# EAGLE design riffle-0.5 (EAGLE 7.2.0)
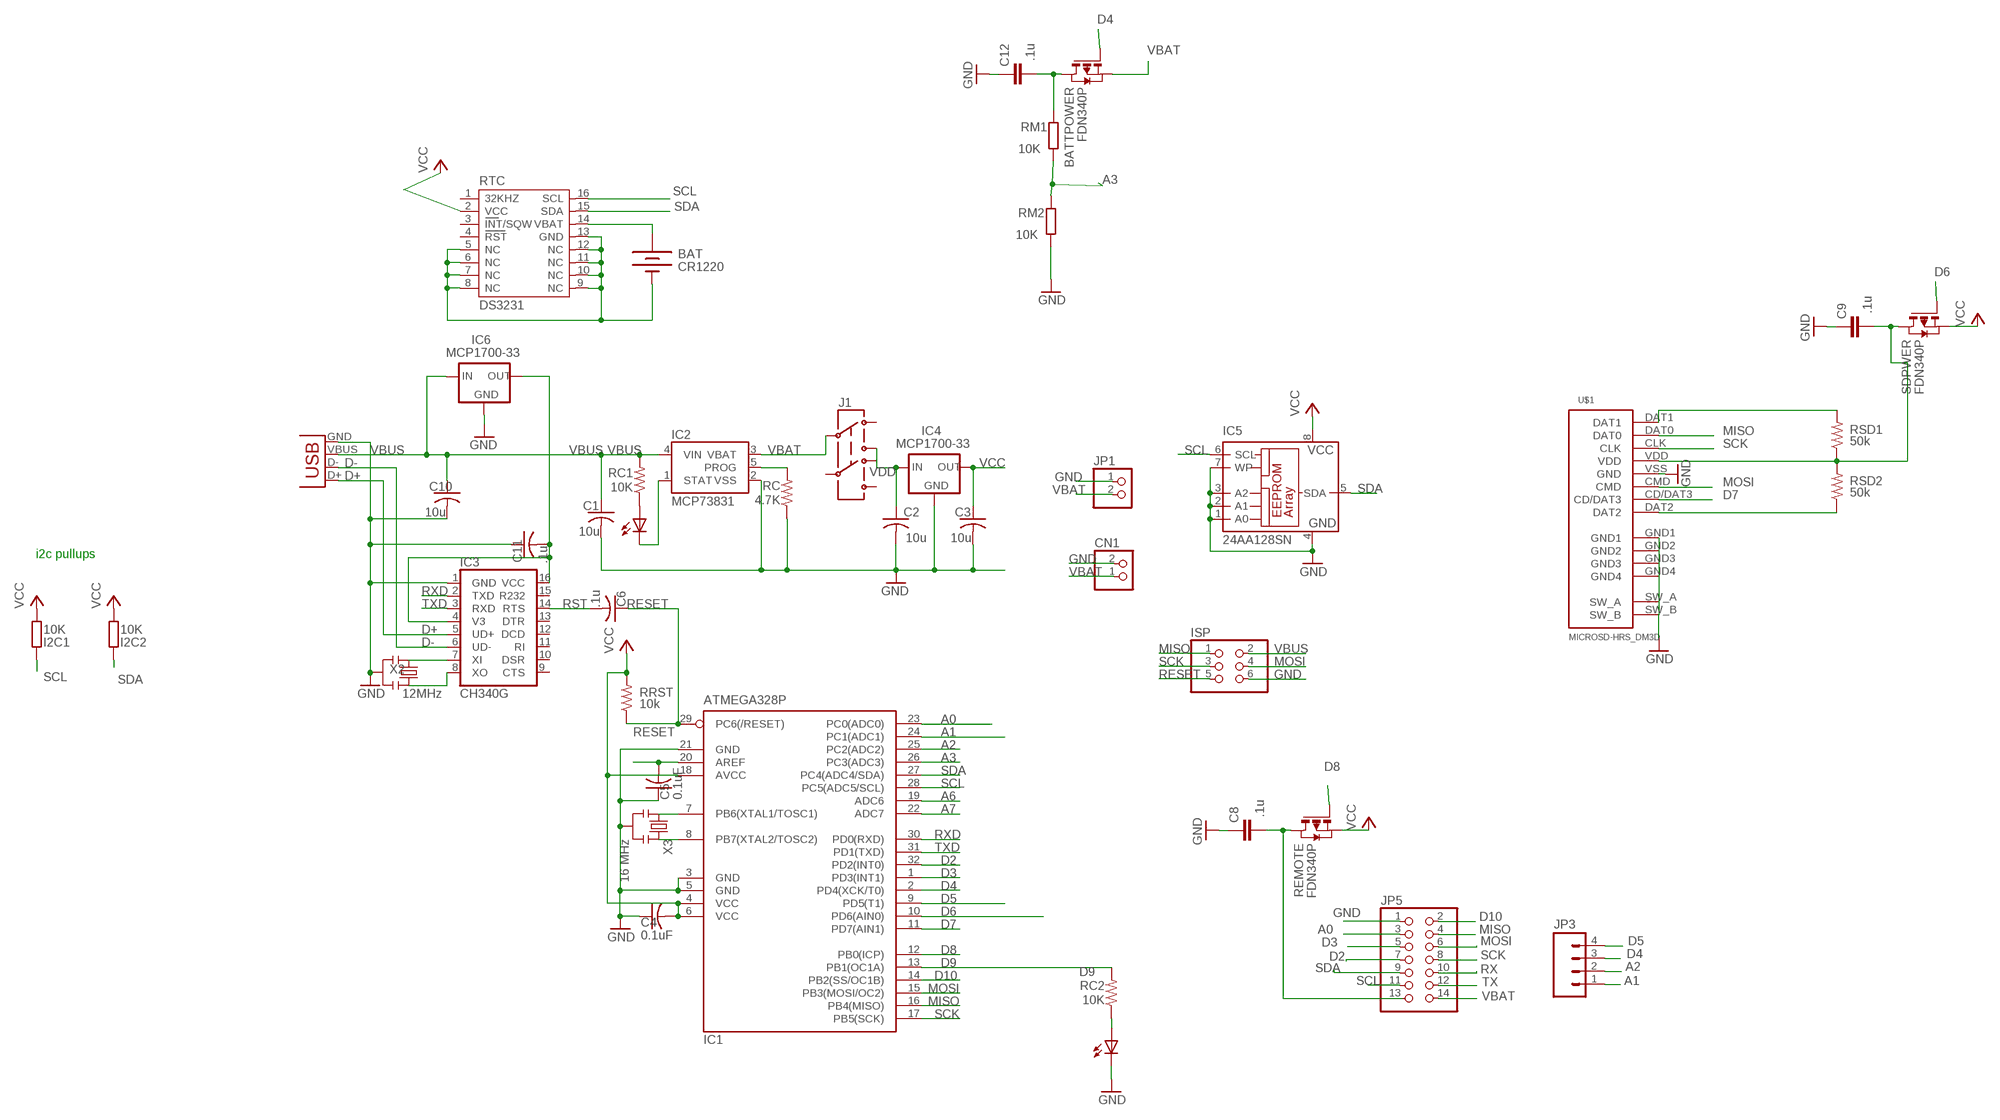
[diagram p0: schematic, sheet 1]

## Parts
BAT  CR1220  BATTERYBATTERY_12MM_SMT  [BATTCON_12MM_SMT]
BATTPOWER  FDN340P  PMOSSOT23  [SOT-23]
C1  10u  C-USC0805K  [C0805K]
C2  10u  C-USC0805K  [C0805K]
C3  10u  C-USC0805K  [C0805K]
C4  0.1uF  C-USC0805K  [C0805K]
C5  0.1uF  C-USC0805K  [C0805K]
C6  .1u  C-USC0805K  [C0805K]
C8  .1u  C-EUC0805  [C0805]
C9  .1u  C-EUC0805  [C0805]
C10  10u  C-USC0805K  [C0805K]
C11  .1u  C-USC0805K  [C0805K]
C12  .1u  C-EUC0805  [C0805]
CHG  0805  LEDCHIPLED_0805  [CHIPLED_0805]
CN1  JST_2PIN-SMT-RA  [JST-PH-2-SMT-RA]
I2C1  10K  R-EU_R0805  [R0805]
I2C2  10K  R-EU_R0805  [R0805]
IC1  ATMEGA328P  MEGA8-AI  [TQFP32-08]
IC2  MCP73831  [SOT23-5]
IC3  CH340G  [SO16]
IC4  MCP1700-33  MCP1700SOT89  [SOT89]
IC5  24AA128SN  [SO-08]
IC6  MCP1700-33  MCP1700SOT89  [SOT89]
ISP  PINHD-2X3  [2X03]
J1  AYZ0202  [AYZ0202]
JP1  PINHD-1X2  [1X02]
JP3  M04SMD  [1X04-SMD]
JP5  PINHD-2X7  [2X07]
RC  4.7K  R-US_R0805  [R0805]
RC1  10K  R-US_R0805  [R0805]
RC2  10K  R-US_R0805  [R0805]
REMOTE  FDN340P  PMOSSOT23  [SOT-23]
RM1  10K  R-EU_R0805  [R0805]
RM2  10K  R-EU_R0805  [R0805]
RRST  10k  R-US_R0805  [R0805]
RSD1  50k  R-US_R0805  [R0805]
RSD2  50k  R-US_R0805  [R0805]
RTC  DS3231  [DS3231]
SDPWER  FDN340P  PMOSSOT23  [SOT-23]
STAT  0805  LEDCHIPLED_0805  [CHIPLED_0805]
U$1  MICROSD-HRS_DM3D  [DM3D]
X1  USBSMD  [USB-MINIB]
X2  12MHz  RESONATORSMD  [RESONATOR-SMD]
X3  16 MHz  RESONATORSMD  [RESONATOR-SMD]

## Nets
A0: IC1.23(PC0(ADC0)) JP5.3
A1: IC1.24(PC1(ADC1)) JP3.1
A2: IC1.25(PC2(ADC2)) JP3.2
A3: IC1.26(PC3(ADC3)) RM1.1 RM2.2
A6: IC1.19(ADC6)
A7: IC1.22(ADC7)
AREF: C5.2 IC1.20(AREF)
D2: IC1.32(PD2(INT0)) JP5.7
D3: IC1.1(PD3(INT1)) JP5.5
D4: BATTPOWER.3(G) IC1.2(PD4(XCK/T0)) JP3.3
D5: IC1.9(PD5(T1)) JP3.4
D6: IC1.10(PD6(AIN0)) SDPWER.3(G)
D7: IC1.11(PD7(AIN1)) U$1.CD/DAT3
D8: IC1.12(PB0(ICP)) REMOTE.3(G)
D9: IC1.13(PB1(OC1A)) RC2.2
D10: IC1.14(PB2(SS/OC1B)) JP5.2
D+: IC3.5(UD+) X1.D+
D-: IC3.6(UD-) X1.D-
GND: BAT.P$1(-) C1.2 C2.2 C3.2 C4.1 C5.1 C8.1 C9.1 C10.2 C11.1 C12.1 CN1.2 IC1.3(GND) IC1.5(GND) IC1.21(GND) IC2.2(VSS) IC3.1(GND) IC4.1(GND) IC5.1(A0) IC5.2(A1) IC5.3(A2) IC5.4(GND) IC5.7(WP) IC6.1(GND) ISP.6 JP1.1 JP5.1 RC.1 RM2.1 RTC.5(NC) RTC.6(NC) RTC.7(NC) RTC.8(NC) RTC.9(NC) RTC.10(NC) RTC.11(NC) RTC.12(NC) RTC.13(GND) STAT.C U$1.GND1 U$1.GND2 U$1.GND3 U$1.GND4 U$1.SW_A U$1.SW_B U$1.VSS(GND) X1.GND X2.2 X3.2
MISO: IC1.16(PB4(MISO)) ISP.1 JP5.4 U$1.DAT0
MOSI: IC1.15(PB3(MOSI/OC2)) ISP.4 JP5.6 U$1.CMD
N$2: IC1.7(PB6(XTAL1/TOSC1)) X3.1
N$3: IC1.8(PB7(XTAL2/TOSC2)) X3.3
N$4: C9.2 RSD1.1 RSD2.2 SDPWER.1(D) U$1.VDD
N$5: CHG.C IC2.1(STAT)
N$6: IC2.5(PROG) RC.2
N$7: C8.2 JP5.13 REMOTE.1(D)
N$8: C11.2 IC3.4(V3) IC3.16(VCC) IC6.3(OUT)
N$9: CHG.A RC1.1
N$11: IC3.7(XI) X2.1
N$13: IC3.8(XO) X2.3
N$15: BATTPOWER.1(D) C12.2 RM1.2
N$16: RSD1.2 U$1.DAT1
N$17: RC2.1 STAT.A
N$18: RSD2.1 U$1.DAT2
RESET: C6.1 IC1.29(PC6(/RESET)) ISP.5 RRST.1
RST: C6.2 IC3.14(RTS)
RTC_BATT: BAT.P$2(+) RTC.14(VBAT)
RX: JP5.10
RXD: IC1.30(PD0(RXD)) IC3.2(TXD)
SCK: IC1.17(PB5(SCK)) ISP.3 JP5.8 U$1.CLK
SCL: I2C1.2 IC1.28(PC5(ADC5/SCL)) IC5.6(SCL) JP5.11 RTC.16(SCL)
SDA: I2C2.2 IC1.27(PC4(ADC4/SDA)) IC5.5(SDA) JP5.9 RTC.15(SDA)
TX: JP5.12
TXD: IC1.31(PD1(TXD)) IC3.3(RXD)
VBAT [vcc]: BATTPOWER.2(S) CN1.1 IC2.3(VBAT) J1.2 JP1.2 JP5.14
VBUS [vcc]: C1.1 C10.1 IC2.4(VIN) IC6.2(IN) ISP.2 RC1.2 X1.VBUS
VCC: C3.1 C4.2 I2C1.1 I2C2.1 IC1.4(VCC) IC1.6(VCC) IC1.18(AVCC) IC4.3(OUT) IC5.8(VCC) REMOTE.2(S) RRST.2 RTC.2(VCC) SDPWER.2(S)
VDD: C2.1 IC4.2(IN) J1.1
Unconnected: IC3.9(CTS) IC3.10(DSR) IC3.11(RI) IC3.12(DCD) IC3.13(DTR) IC3.15(R232) J1.3 J1.4 J1.5 J1.6 RTC.1(32KHZ) RTC.3(INT/SQW) RTC.4(RST)

## Notes on the sheet
- i2c pullups

## Library data of the parts
BAT = SparkFunNew:BATTERY: Battery Holders Various common sizes : AA, AAA, 20mm coin cell and 12mm coin cell.
BATTPOWER REMOTE SDPWER = zetex:PMOSSOT23: MOS FET
C1-C6 C10 C11 = adafruit2013:C-US: CAPACITOR, American symbol
C8 C9 C12 = resistor:C-EU: CAPACITOR, European symbol
CHG STAT = led:LED: LED OSRAM: - CHIPLED LG R971, LG N971, LY N971, LG Q971, LY Q971, LO R971, LY R971 LH N974, LH R974 LS Q976, LO Q976, LY Q976 LO Q996 - Hyper CHIPLED LW Q18S LB Q993, LB Q99A, LB R99A - SideLED LS A670, LO A670, LY A670, LG A670, LP A670 LB A673, LV A673, LT A673, LW A673 LH A674 LY A675 LS A676, LA A676, LO A676, LY A676, LW A676 LS A679, LY A679, LG A679 - Hyper Micro SIDELED® LS Y876, LA Y876, LO Y876, LY Y876 LT Y87S - SmartLED LW L88C, LW L88S LB L89C, LB L89S, LG L890 LS L89K, LO L89K, LY L89K LS L896, LA L896, LO L896, LY L896 - TOPLED LS T670, LO T670, LY T670, LG T670, LP T670 LSG T670, LSP T670, LSY T670, LOP T670, LYG T670 LG T671, LOG T671, LSG T671 LB T673, LV T673, LT T673, LW T673 LH T674 LS T676, LA T676, LO T676, LY T676, LB T676, LH T676, LSB T676, LW T676 LB T67C, LV T67C, LT T67C, LS T67K, LO T67K, LY T67K, LW E67C LS E67B, LA E67B, LO E67B, LY E67B, LB E67C, LV E67C, LT E67C LW T67C LS T679, LY T679, LG T679 LS T770, LO T770, LY T770, LG T770, LP T770 LB T773, LV T773, LT T773, LW T773 LH T774 LS E675, LA E675, LY E675, LS T675 LS T776, LA T776, LO T776, LY T776, LB T776 LHGB T686 LT T68C, LB T68C - Hyper Mini TOPLED® LB M676 - Mini TOPLED Santana® LG M470 LS M47K, LO M47K, LY M47K Source: http://www.osram.convergy.de LUXEON: - LUMILED® LXK2-PW12-R00, LXK2-PW12-S00, LXK2-PW14-U00, LXK2-PW14-V00 LXK2-PM12-R00, LXK2-PM12-S00, LXK2-PM14-U00 LXK2-PE12-Q00, LXK2-PE12-R00, LXK2-PE12-S00, LXK2-PE14-T00, LXK2-PE14-U00 LXK2-PB12-K00, LXK2-PB12-L00, LXK2-PB12-M00, LXK2-PB14-N00, LXK2-PB14-P00, LXK2-PB14-Q00 LXK2-PR12-L00, LXK2-PR12-M00, LXK2-PR14-Q00, LXK2-PR14-R00 LXK2-PD12-Q00, LXK2-PD12-R00, LXK2-PD12-S00 LXK2-PH12-R00, LXK2-PH12-S00 LXK2-PL12-P00, LXK2-PL12-Q00, LXK2-PL12-R00 Source: www.luxeon.com KINGBRIGHT: KA-3528ASYC Source: www.kingbright.com
CN1 = adafruit:JST_2PIN: JST 2-Pin Connectors of various flavors SMT-RA (S2B-PH-SM4) 4UConnector #17311 SMT (B2B-PH-SM4) THM-RA (S2B-PH) THM (B2B-PH)
I2C1 I2C2 RM1 RM2 = rcl:R-EU_: RESISTOR, European symbol
IC1 = atmel:MEGA8: MICROCONTROLLER 8 Kbytes FLASH, 1 kbytes SRAM, 512 bytes EEPROM, USART, 6-channel 10 bit ADC, 2-channel 8 bit ADC Pin compatible with Atmega48, ATMega88, ATMega168 Source: avr.lbr; MPN: ATMEGA8-16AU; OC_FARNELL: 9171371; OC_NEWARK: 73M8863
IC2 = SparkFunNew:MCP73831: Microchip's MCP73831 Miniature single cell, fully integrated Li-Ion, Li-polymer charge management controller http://ww1.microchip.com/downloads/en/DeviceDoc/21984a.pdf
IC3 = SparkFunNew:CH340
IC4 IC6 = adafruit:MCP1700: VOLTAGE REGULATOR
IC5 = microchip:24*: Serial EEPROM I2C; MF: MICROCHIP; MPN: 24AA128-I/SN; OC_FARNELL: unknown; OC_NEWARK: 92C6842
ISP = pinhead:PINHD-2X3: PIN HEADER
J1 = SparkFunNew:AYZ0202: SPDT Slide Switch Simple SMD single-pull double-throw slide switch. Good for less than 350mA power switch, switching UARTs between devices, etc. Spark Fun Electronics SKU : COM-00597
JP1 = pinhead:PINHD-1X2: PIN HEADER
JP3 = SparkFun:M04: Header 4 Standard 4-pin 0.1" header. Use with straight break away headers (SKU : PRT-00116), right angle break away headers (PRT-00553), swiss pins (PRT-00743), machine pins (PRT-00117), and female headers (PRT-00115). Molex polarized connector foot print use with SKU : PRT-08231 with associated crimp pins and housings.
JP5 = pinhead:PINHD-2X7: PIN HEADER
RC RC1 RC2 RRST RSD1 RSD2 = adafruit2013:R-US_: RESISTOR, American symbol
RTC = _lh-library:DS3231
U$1 = hrs_DM3D-SF:MICROSD-HRS_DM3D
X1 = SparkFun:USB: USB Connectors USB-B-PTH is fully proven SKU : PRT-00139 USB-miniB is fully proven SKU : PRT-00587 USB-A-PCB is untested. USB-A-H is throughly reviewed, but untested. Spark Fun Electronics SKU : PRT-00437 USB-B-SMT is throughly reviewed, but untested. Needs silkscreen touching up. USB-A-S has not been used/tested USB-MB-H has not been used/tested
X2 = SparkFunNew:RESONATOR: Resonator Small SMD resonator. This is the itty bitty 10/20MHz resonators with built in caps. CSTCE10M0G55 and CSTCE20M0V53. Footprint has been reviewed closely but hasn't been tested yet.
X3 = SparkFun:RESONATOR: Resonator Small SMD resonator. This is the itty bitty 10/20MHz resonators with built in caps. CSTCE10M0G55 and CSTCE20M0V53. Footprint has been reviewed closely but hasn't been tested yet.

## Board
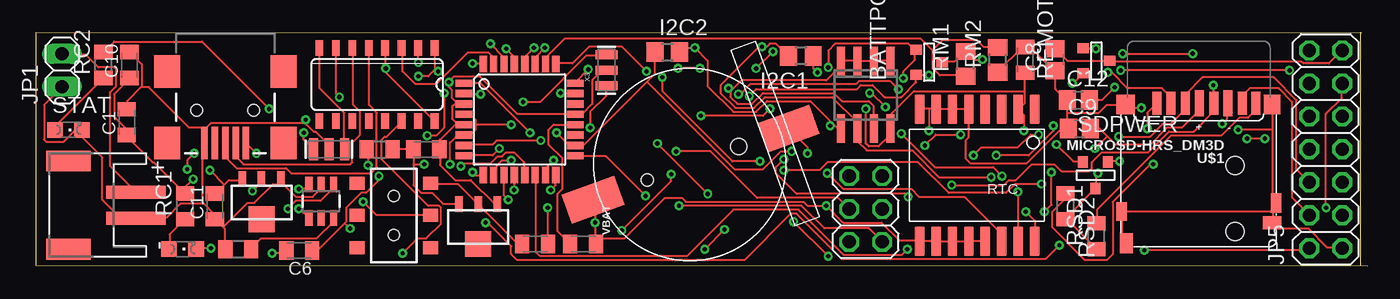
[diagram p1: board, top side]
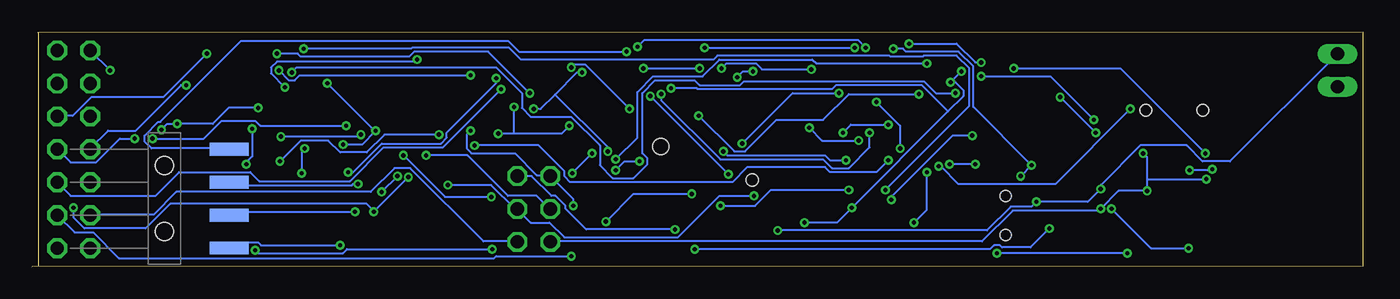
[diagram p2: board, bottom side, seen from below]

Size 102.67 x 18.03 mm. Coordinates in mm from the lower left corner, seen from the top.
Outline: 102.27,18.01 0,18.03 0,0.03 102.67,0
Outline: 102.2,0.03 102.2,18.03
Copper layers (1*16): Top 0.0356mm / dielectric 1.5011mm / Bottom 0.0356mm
Design rules "LaenPCBOrder": minimum track width 6mil, minimum drill 13mil, track to track 6mil, track to pad 6mil, pad to pad 6mil, via to via 6mil, smd to smd 6mil, copper to edge 15mil, drill to drill 6mil, minimum pad ring 7mil, minimum via ring 7mil, stop-mask expansion 3mil, vias tented up to drill 0mil, thermal gap 10mil

### Footprints (pad centres in the part's own frame; a part is rotated, then mirrored left to right if it is on the bottom)
BATTCON_12MM_SMT = smd 2.4 x 4.3: P$1 0,11.96 | smd 2.4 x 4.2: P$2 0,-4.1 | hole 0.95: 0,7.5 | hole 1.25: 0,0
SOT-23 = smd 0.787 x 0.889: 1 0.025,-1.016; 2 -0.94,1.016; 3 0.991,1.016
C0805K = smd 1.1 x 1.4: 1 -1,0; 2 1,0
C0805 = smd 1.3 x 1.5: 1 -0.85,0; 2 0.85,0
CHIPLED_0805 = smd 1.2 x 1.2: A 0,-1.05; C 0,1.05
JST-PH-2-SMT-RA = smd 1 x 4.6: 1 1,-3.7; 2 -1,-3.7 | smd 1.6 x 3.4: NC1 -3.4,1.5; NC2 3.4,1.5
R0805 = smd 1.3 x 1.5: 1 -0.95,0; 2 0.95,0
TQFP32-08 = smd 1.27 x 0.559: 1 -4.293,2.8; 2 -4.293,2; 3 -4.293,1.2; 4 -4.293,0.4; 5 -4.293,-0.4; 6 -4.293,-1.2; 7 -4.293,-2; 8 -4.293,-2.8; 17 4.293,-2.8; 18 4.293,-2; 19 4.293,-1.2; 20 4.293,-0.4; 21 4.293,0.4; 22 4.293,1.2; 23 4.293,2; 24 4.293,2.8 | smd 0.559 x 1.27: 9 -2.8,-4.293; 10 -2,-4.293; 11 -1.2,-4.293; 12 -0.4,-4.293; 13 0.4,-4.293; 14 1.2,-4.293; 15 2,-4.293; 16 2.8,-4.293; 25 2.8,4.293; 26 2,4.293; 27 1.2,4.293; 28 0.4,4.293; 29 -0.4,4.293; 30 -1.2,4.293; 31 -2,4.293; 32 -2.8,4.293
SOT23-5 = smd 0.55 x 1.2: 1 -0.95,-1.3; 2 0,-1.3; 3 0.95,-1.3; 4 0.95,1.3; 5 -0.95,1.3; 6 0,1.3
SO16 = smd 0.6 x 1.2: 1 -4.445,-2.8; 2 -3.175,-2.8; 3 -1.905,-2.8; 4 -0.635,-2.8; 5 0.635,-2.8; 6 1.905,-2.8; 7 3.175,-2.8; 8 4.445,-2.8; 9 4.445,2.8; 10 3.175,2.8; 11 1.905,2.8; 12 0.635,2.8; 13 -0.635,2.8; 14 -1.905,2.8; 15 -3.175,2.8; 16 -4.445,2.8
SOT89 = smd 0.58 x 1.2: 1 -1.5,-1.8; 2 0,-1.8; 3 1.5,-1.8 | smd 2 x 2: 4 0,1.3
SO-08 = smd 0.6 x 2.2: 1 -1.905,-2.6; 2 -0.635,-2.6; 3 0.635,-2.6; 4 1.905,-2.6; 5 1.905,2.6; 6 0.635,2.6; 7 -0.635,2.6; 8 -1.905,2.6
2X03 = drill 1.016 octagon: 1 -2.54,-1.27; 2 -2.54,1.27; 3 0,-1.27; 4 0,1.27; 5 2.54,-1.27; 6 2.54,1.27
AYZ0202 = smd 1 x 1.15: 1 -2.5,2.825; 2 0,2.825; 3 2.5,2.825; 4 -2.5,-2.825; 5 0,-2.825; 6 2.5,-2.825 | hole 0.85: 1.5,0; -1.5,0
1X02 = drill 1.016 long: 1 -1.27,0; 2 1.27,0
1X04-SMD = smd 1 x 3: 1 -3.81,5; 2 -1.27,5; 3 1.27,5; 4 3.81,5 | hole 1.4: -2.54,0; 2.54,0
2X07 = drill 1.016 octagon: 1 -7.62,-1.27; 2 -7.62,1.27; 3 -5.08,-1.27; 4 -5.08,1.27; 5 -2.54,-1.27; 6 -2.54,1.27; 7 0,-1.27; 8 0,1.27; 9 2.54,-1.27; 10 2.54,1.27; 11 5.08,-1.27; 12 5.08,1.27; 13 7.62,-1.27; 14 7.62,1.27
R0805' = smd 1.1 x 1.4: 1 -1,0; 2 1,0
DS3231 = smd 0.762 x 2.286: 1 -4.445,-5.08; 2 -3.175,-5.08; 3 -1.905,-5.08; 4 -0.635,-5.08; 5 0.635,-5.08; 6 1.905,-5.08; 7 3.175,-5.08; 8 4.445,-5.08; 9 4.445,5.08; 10 3.175,5.08; 11 1.905,5.08; 12 0.635,5.08; 13 -0.635,5.08; 14 -1.905,5.08; 15 -3.175,5.08; 16 -4.445,5.08
DM3D = smd 0.7 x 1.75: CD/DAT3 8.15,0.45; CLK 4.85,0.45; CMD 7.05,0.45; DAT0 2.65,0.45; DAT1 1.6,0.45; DAT2 9.25,0.45 | smd 0.8 x 1.5: GND1 0.05,8.15 | smd 0.8 x 1.4: GND2 11.95,8.8 | smd 1.4 x 1.5: GND3 11.65,0.55 | smd 1.3 x 1.5: GND4 0.35,0.55 | smd 1 x 1.55: SW_A 11.6,11.25 | smd 1.4 x 1: SW_B 0.35,9.65 | smd 0.7 x 2.032: VDD 5.95,0.45; VSS 3.75,0.45
USB-MINIB = smd 2.5 x 0.5: D+ 2.5,0; D- 2.5,0.8; GND 2.5,-1.6; ID 2.5,-0.8; VBUS 2.5,1.6 | smd 2.5 x 2: GND@1 -3,-4.5; GND@2 -3,4.5; GND@3 2.5,4.5; GND@4 2.5,-4.5 | hole 0.9: 0,2.2; 0,-2.2
RESONATOR-SMD = smd 0.7 x 1.7: 1 -1.2,0; 2 0,0; 3 1.2,0

### Placement (x,y rotation side)
BAT  54.19,9.22 110 top
BATTPOWER  68.89,15.72 90 top
C1  6.99,11.12 90 top
C2  38.49,1.72 0 top
C3  30.09,9.02 0 top
C4  76.29,15.92 270 top
C5  42.19,1.72 180 top
C6  20.29,1.22 180 top
C8  78.59,15.92 90 top
C9  80.49,10.62 0 top
C10  7.19,15.52 90 top
C11  13.79,4.62 90 top
C12  80.39,12.82 0 top
CHG  11.29,1.32 270 top
CN1  3.99,4.72 90 top
I2C1  58.99,16.22 180 top
I2C2  48.69,16.52 0 top
IC1  37.29,11.32 0 top
IC2  21.99,5.02 180 top
IC3  26.29,14.02 180 top
IC4  34.09,3.02 180 top
IC5  63.99,13.22 180 top
IC6  17.39,4.92 180 top
ISP  63.99,4.42 90 top
J1  27.59,3.92 270 top
JP1  1.99,15.12 90 top
JP3  92.49,5.22 270 bottom
JP5  99.49,9.02 90 top
RC  4.7K  [R0805']  15.59,1.32 0 top
RC1  10K  [R0805']  11.49,4.62 90 top
RC2  10K  [R0805']  5.19,15.52 90 top
REMOTE  81.79,15.82 90 top
RM1  71.69,15.62 90 top
RM2  74.19,15.92 90 top
RRST  10k  [R0805']  26.49,9.02 0 top
RSD1  50k  [R0805']  81.79,2.32 90 top
RSD2  50k  [R0805']  79.39,4.62 270 top
RTC  72.59,7.02 180 top
SDPWER  81.69,7.02 0 top
STAT  2.49,10.52 270 top
U$1  95.69,13.02 180 top
X1  14.59,12.02 270 top
X2  22.59,9.02 0 top
X3  43.99,15.12 90 top

### Tracks (layer width: path | path; a pad name or v marks a point on that pad's centre or on a via)
A0  (via drill 0.33)
  Top 0.152: v40.45,13.35 41.52,13.35 IC1.23 | v51.8,5.58 v47.92,9.47 | v61.1,0.78 v58.43,3.45
  Bottom 0.152: v40.45,13.35 44.03,13.35 v47.92,9.47 | v51.8,5.58 56.3,5.58 v58.43,3.45 | v61.1,0.78 66.89,0.78 67.04,0.63 96,0.63 97.98,2.61 99.43,2.61 100.72,3.9 JP5.3
A1  (via drill 0.33)
  Top 0.152: v42.58,15.18 41.59,14.19 IC1.24 | v51.19,15.26 v49.52,15.26 | v56.83,16.55 v55.54,15.26
  Bottom 0.152: v42.58,15.18 46.39,15.18 46.85,15.64 49.14,15.64 v49.52,15.26 | v55.54,15.26 v51.19,15.26 | v56.83,16.55 65.14,16.55 65.98,17.39 86.55,17.39 92.8,11.14 92.95,11.14 94.02,10.07 94.02,9.62 93.48,9.08 87.54,9.08 JP3.1
A2  (via drill 0.33)
  Top 0.152: v47.08,15.03 45.17,16.93 42.66,16.93 41.36,15.64 40.14,15.64 IC1.25 | v48.3,14.57 48.3,13.5 53.71,8.09 v55.84,8.09 | v57.67,7.41 60.41,7.41 61.02,8.02 68.03,8.02 70.4,5.66 74.82,5.66 75.5,6.34 v77.56,6.34
  Bottom 0.152: v47.08,15.03 47.84,15.03 v48.3,14.57 | v55.84,8.09 56.99,8.09 v57.67,7.41 | v77.56,6.34 77.94,6.34 78.02,6.27 87.31,6.27 87.47,6.42 JP3.2
A3
  Top 0.152: 69.14,16.67 69.18,16.63 69.18,15.26 69.71,14.72 71.62,14.72 RM1.1 | 69.14,16.67 68.26,17.54 40.75,17.54 39.31,16.09 39.31,15.64 IC1.26 | 69.14,16.67 69.94,17.47 72.53,17.47 73.06,16.93 74.13,16.93 RM2.2
AREF
  Top 0.152: IC1.20 41.52,10.91 39.92,10.91 39.54,10.53 39.54,9.39 40.6,8.32 40.6,5.96 40.22,5.58 40.22,2.68 41.14,1.77 C5.2
D2  (via drill 0.33)
  Top 0.152: v33.67,15.64 34.43,15.64 IC1.32 | v57.67,8.25 57.06,7.64 57.06,7.18 58.66,5.58 67.04,5.58 v67.27,5.35 | v74.05,8.55 76.57,8.55 78.47,10.46 v78.47,10.84 | v94.78,9.85 v93.41,9.85
  Bottom 0.152: v33.67,15.64 42.2,15.64 42.51,15.94 49.67,15.94 50.97,14.65 54.78,14.65 55.99,13.43 55.99,9.92 v57.67,8.25 | v67.27,5.35 70.85,5.35 v74.05,8.55 | v78.47,10.84 85.1,10.84 85.48,11.22 88.07,11.22 89.45,9.85 v93.41,9.85 | v94.78,9.85 95.92,9.85 97.75,8.02 99.73,8.02 100.72,9.01 JP5.7
D3  (via drill 0.33)
  Top 0.152: v38.09,10.3 34.28,14.11 33.06,14.11 IC1.1 | v54.17,13.28 54.32,13.28 55.08,14.04 63.23,14.04 63.46,14.27 65.9,14.27 v66.51,13.66
  Bottom 0.152: v38.09,10.3 38.09,9.16 39.69,7.56 40.98,7.56 41.67,8.25 49.59,8.25 54.17,12.82 v54.17,13.28 | v66.51,13.66 71.01,9.16 75.58,9.16 78.17,6.57 85.18,6.57 85.86,7.26 91.35,7.26 93.18,5.43 99.73,5.43 100.72,6.42 JP5.5
D4  (via drill 0.33)
  Top 0.152: v66.89,14.49 66.89,15.03 67.81,15.94 67.81,16.7 BATTPOWER.3 67.73,16.7 67.27,17.16 61.63,17.16 61.1,16.63 v61.1,15.33 | v78.32,7.26 78.32,4.74 v77.79,4.21 | v34.28,13.28 33.06,13.28 IC1.2 | v51.27,11.6 56.07,11.6 v56.6,12.13
  Bottom 0.152: v66.89,14.49 66.89,14.11 70.7,10.3 70.7,9.92 71.16,9.47 75.73,9.47 77.94,7.26 v78.32,7.26 | v77.79,4.21 87.24,4.21 87.47,3.98 JP3.3 | v34.28,13.28 39.69,13.28 41.67,11.29 45.25,11.29 47.69,8.86 48.53,8.86 v51.27,11.6 | v56.6,12.13 60.03,15.56 60.87,15.56 v61.1,15.33
D5  (via drill 0.33)
  Top 0.152: v33.67,7.26 33.9,7.03 34.43,7.03 IC1.9 | v34.66,3.37 34.81,3.37 36.64,1.54 36.64,0.93 37.1,0.47 54.62,0.47 58.2,4.06 58.66,4.06 62.17,0.55 77.86,0.55 v78.93,1.62
  Bottom 0.152: v33.67,7.26 33.67,4.36 v34.66,3.37 | v78.93,1.62 85.03,1.62 85.26,1.85 87.08,1.85 87.47,1.46 JP3.4
D6  (via drill 0.33)
  Top 0.152: v83.58,8.09 82.74,8.09 SDPWER.3 | v71.31,10.15 69.41,10.15 v68.57,9.31 | v36.64,8.17 35.95,8.17 35.34,7.56 35.34,7.03 IC1.10
  Bottom 0.152: v83.58,8.09 81.98,9.69 79.85,9.69 78.93,8.78 76.87,8.78 75.5,10.15 v71.31,10.15 | v68.57,9.31 63.61,9.31 61.63,7.33 61.63,6.95 61.18,6.49 48.68,6.49 47.54,7.64 41.52,7.64 41.14,7.26 37.55,7.26 v36.64,8.17
D7  (via drill 0.33)
  Top 0.152: v36.41,5.12 36.11,5.43 36.11,6.95 IC1.11 | v30.16,10.07 30.85,10.07 31.46,10.68 v31.46,13.35 | v82.66,14.95 82.97,14.95 84.19,13.73 86.86,13.73 87.47,13.12 87.47,12.59 U$1.CD/DAT3
  Bottom 0.152: v36.41,5.12 36.41,5.35 31.69,10.07 v30.16,10.07 | v31.46,13.35 32.98,13.35 33.9,14.27 47.76,14.27 48.07,13.96 51.19,13.96 51.57,14.34 54.62,14.34 55.61,13.35 55.61,8.7 55.23,8.32 55.23,7.87 56.3,6.8 57.9,6.8 58.89,7.79 58.89,9.31 61.1,11.52 64.22,11.52 64.91,12.21 64.91,13.35 66.89,15.33 82.28,15.33 v82.66,14.95
D8  (via drill 0.33)
  Top 0.152: v81.75,16.78 80.84,16.78 REMOTE.3 | v36.87,5.88 36.87,6.95 IC1.12
  Bottom 0.152: v81.75,16.78 73.44,16.78 73.37,16.86 65.9,16.86 64.99,15.94 50.13,15.94 49.82,16.25 36.56,16.25 36.49,16.17 33.97,16.17 33.9,16.25 31.38,16.25 30.39,15.26 30.39,12.36 v36.87,5.88
D9  (via drill 0.33)
  Top 0.152: v32.75,7.71 32.98,7.94 35.04,7.94 35.57,8.47 35.95,8.47 36.26,8.78 36.87,8.78 37.63,8.02 37.63,7.03 IC1.13 | v17.97,12.13 12.79,17.31 6.01,17.31 5.25,16.55 RC2.2
  Bottom 0.152: v32.75,7.71 32.6,7.71 31.23,6.34 23.76,6.34 v17.97,12.13
D10  (via drill 0.33)
  Top 0.152: v67.2,1.31 66.74,0.85 62.32,0.85 58.81,4.36 53.78,4.36 50.2,0.78 38.85,0.78 38.54,1.08 38.54,6.95 IC1.14 | v85.48,1.24 98.06,1.24 JP5.2
  Bottom 0.152: v67.2,1.31 78.4,1.31 78.7,1.01 85.26,1.01 v85.48,1.24
D+
  Top 0.152: IC3.5 25.67,16.78 25.67,12.44 26.28,11.83 26.28,7.64 25.82,7.18 19.65,7.18 19.27,7.56 15.46,7.56 14.62,8.4 14.62,9.47 X1.D+
D-
  Top 0.152: IC3.6 24.45,16.78 24.45,12.44 24.98,11.9 24.98,10.15 24.37,9.54 24.37,8.02 24.22,7.87 15.99,7.87 15.46,8.4 15.46,9.47 X1.D-
GND  (via drill 0.33)
  Top 0.152: U$1.SW_A 84.04,1.77 83.81,2 83.81,4.21 U$1.GND2 83.88,4.21 95.39,4.21 | 95.39,4.21 95.39,4.59 95.62,4.82 U$1.GND1 | 95.39,4.21 95.39,3.37 U$1.SW_B 95.47,3.37 95.92,2.91 98.13,2.91 99.58,1.46 100.72,1.46 JP5.1 | 95.39,10.53 95.39,5.12 95.62,4.89 U$1.GND1 | 95.39,10.53 95.39,12.44 U$1.GND4 | v91.5,10.99 91.88,11.37 91.88,12.51 U$1.VSS | 95.39,10.53 v92.72,10.53 | 95.39,4.21 U$1.GND1 | RM2.1 74.21,15.03 76.04,16.86 76.26,16.86 C4.1 76.34,16.86 76.72,16.86 78.55,15.03 C8.1 78.63,15.03 78.63,13.66 79.46,12.82 C12.1 79.54,12.74 79.54,11.83 | 79.54,11.83 79.54,10.76 79.62,10.68 C9.1 79.54,10.68 79.16,10.68 76.42,7.94 72.07,7.94 71.69,8.32 71.69,9.69 71.92,9.92 71.92,12.06 RTC.5 71.92,12.13 70.7,12.13 RTC.6 70.62,12.13 69.48,12.13 RTC.7 69.41,12.13 68.87,12.13 | 79.54,11.83 81.98,11.83 82.59,12.44 84.04,12.44 U$1.GND3 84.11,12.44 84.34,12.21 v85.26,12.21 | RTC.13 73.22,1.92 72,1.92 RTC.12 71.92,1.92 70.7,1.92 RTC.11 70.62,1.92 69.48,1.92 RTC.10 69.41,1.92 68.19,1.92 RTC.9 68.11,2 66.59,2 65.21,3.37 62.24,3.37 v60.95,4.67 59.5,4.67 59.19,4.97 50.13,4.97 49.82,5.28 48.53,5.28 45.4,2.15 43.12,2.15 | 68.87,12.13 68.19,12.13 RTC.8 | 68.87,12.13 v68.87,10.46 | JP1.1 1.97,13.81 0.6,12.44 0.6,9.77 0.75,9.62 2.12,9.62 2.96,10.46 3.49,10.46 STAT.C 3.49,10.38 3.49,10 5.09,8.4 5.09,5.12 6.46,3.75 7.68,3.75 CN1.2 7.76,3.75 10.05,3.75 11.11,4.82 12.87,4.82 12.9,4.86 | IC2.2 21.93,6.27 21.93,5.96 21.32,5.35 20.03,5.35 18.96,6.42 18.96,6.65 IC6.1 18.96,6.34 18.28,6.34 16.83,4.89 16.29,4.89 14.43,3.03 | 14.43,3.03 13.86,3.6 C11.1 13.78,3.67 13.78,3.98 12.9,4.86
  Top 0.152: 14.43,3.03 14.54,2.91 14.54,1.39 RC.1 | 8.1,13.85 8.14,13.88 8.14,15.56 7.23,16.48 C10.2 | 8.1,13.85 7,12.74 7,12.13 C1.2 | 20.75,11.03 20.71,11.07 13.47,11.07 13.02,10.61 13.02,9.54 X1.GND | 20.75,11.03 21.4,10.38 21.55,10.38 22.54,9.39 22.54,9.08 X2.2 | 8.1,13.85 8.14,13.81 8.67,13.81 11.8,10.68 13.02,10.68 X1.GND | 12.9,4.86 12.79,4.97 12.79,9.31 12.94,9.47 X1.GND | IC5.1 65.82,15.87 64.68,15.87 IC5.2 64.61,15.87 63.39,15.87 IC5.3 63.31,15.87 62.17,15.87 IC5.4 | 62.09,15.87 IC5.4 | 53.59,13.54 54.39,14.34 60.95,14.34 62.01,15.41 62.01,15.79 IC5.4 | 53.59,13.54 53.56,13.5 53.56,13.05 54.09,12.51 55.23,12.51 56.07,13.35 61.56,13.35 62.17,12.74 64.22,12.74 64.61,12.36 64.61,10.68 IC5.7 | 43.12,2.15 v43.12,3.37 43.12,4.97 42.96,5.12 BAT.P$1 | 43.12,2.15 43.12,1.77 C5.1 43.12,2.15 | IC4.1 35.57,4.82 35.34,4.82 33.52,6.65 32.3,6.65 31.15,7.79 31.15,9.01 C3.2 31.15,9.08 31.15,9.77 32.37,10.99 IC1.5 32.98,10.99 32.45,10.99 32.07,11.37 32.07,12.29 32.37,12.59 IC1.3 32.98,12.59 32.45,12.59 32.07,12.97 32.07,13.58 31.84,13.81 v31.84,14.19 31.84,14.27 32.22,14.65 34.2,14.65 37.1,11.75 41.52,11.75 IC1.21 | 41.59,11.75 IC1.21 | IC1.21 41.67,11.75 42.13,11.75 42.89,12.51 42.89,14.34 43.65,15.1 43.95,15.1 X3.2 | 30.77,16.86 IC3.1 30.77,16.78 30.77,15.26 v31,15.03 30.77,15.18 30.24,14.65 v29.48,14.65 | v39.46,4.51 39.46,1.77 C2.2 | v53.4,13.73 53.59,13.54 | v20.79,11.29 20.79,11.07 20.75,11.03
  Bottom 0.152: v92.72,10.53 92.27,10.99 v91.5,10.99 88.76,10.99 87.54,12.21 v85.26,12.21 | v68.87,10.46 69.18,10.15 69.18,9.08 68.8,8.7 65.44,8.7 63.77,7.03 62.78,7.03 ISP.6 62.7,6.95 60.95,5.2 v60.95,4.67 | v31,15.03 v31.84,14.19 31.61,14.34 30.85,13.58 30.85,13.12 32.03,11.94 | 32.03,11.94 v39.46,4.51 40.6,3.37 v43.12,3.37 | v53.4,13.73 51.42,13.73 51.35,13.66 40.98,13.66 40.68,13.96 34.05,13.96 32.03,11.94 | v20.79,11.29 24.14,14.65 v29.48,14.65
MISO  (via drill 0.33)
  Top 0.152: U$1.DAT0 93.1,12.59 93.1,13.2 93.64,13.73 95.85,13.73 96.91,12.67 96.91,5.28 98.21,3.98 JP5.4 | v39.69,5.88 40.07,6.27 40.07,6.95 IC1.16 | v49.59,4.67 59.04,4.67 60.8,2.91 64.22,2.91 65.21,1.92 ISP.1
  Bottom 0.152: v39.69,5.88 45.71,5.88 46.93,4.67 v49.59,4.67 | JP5.4 98.21,3.98 93.33,3.98 91.58,5.73 76.57,5.73 74.74,7.56 73.52,7.56 67.88,1.92 65.29,1.92 ISP.1
MOSI  (via drill 0.33)
  Top 0.152: JP5.6 98.21,6.49 97.22,7.49 97.22,12.82 95.47,14.57 89.98,14.57 88.68,13.28 88.68,12.59 U$1.CMD 88.61,12.51 88.61,12.06 87.54,10.99 86.93,10.99 85.94,10 v83.5,10 | v39.92,8.17 39.31,7.56 39.31,7.03 IC1.15 | v49.37,8.86 52.03,8.86 55.61,5.28 61.86,5.28 62.7,4.44 ISP.4 | v77.33,10.15 76.72,10.15 75.73,9.16 72.91,9.16 v72.3,8.55
  Bottom 0.152: v39.92,8.17 41.14,8.17 41.52,8.55 49.06,8.55 v49.37,8.86 | v83.5,10 77.48,10 v77.33,10.15 | v72.3,8.55 69.1,8.55 65.98,5.43 63.77,5.43 62.78,4.44 ISP.4
N$2  (via drill 0.33)
  Top 0.152: v38.93,9.69 35.5,9.69 35.19,9.39 33.06,9.39 IC1.7 | v42.74,10.68 42.74,11.9 43.95,13.12 43.95,13.88 X3.1
  Bottom 0.152: v38.93,9.69 41.75,9.69 v42.74,10.68
N$3  (via drill 0.33)
  Top 0.152: v35.73,9.08 35.19,8.55 33.06,8.55 IC1.8 | v37.55,12.67 38.85,12.67 42.43,16.25 43.95,16.25 X3.3
  Bottom 0.152: v35.73,9.08 35.73,10.84 v37.55,12.67
N$4  (via drill 0.33)
  Top 0.152: RSD1.1 81.75,1.39 79.46,3.67 RSD2.2 79.39,3.67 81.67,5.96 SDPWER.1 81.75,6.04 81.75,7.03 v81.9,7.18 | 82.63,10.04 83.27,9.39 85.94,9.39 87.24,10.68 88.38,10.68 89.67,11.98 89.67,12.51 U$1.VDD | 82.63,10.04 82.05,10.61 81.37,10.61 C9.2 | 82.63,10.04 v81.67,9.08
  Bottom 0.152: v81.9,7.18 81.9,8.86 v81.67,9.08
N$5  (via drill 0.33)
  Top 0.152: v13.47,1.39 12.41,1.39 CHG.C | v19.42,4.44 20.03,5.05 21.93,5.05 22.92,6.04 22.92,6.27 IC2.1
  Bottom 0.152: v13.47,1.39 16.37,1.39 v19.42,4.44
N$6
  Top 0.152: IC2.5 22.92,3.67 22.92,3.45 21.63,2.15 17.36,2.15 16.6,1.39 RC.2
N$7
  Top 0.152: C8.2 78.63,16.78 79.54,15.87 82.74,15.87 REMOTE.1 82.82,15.79 97.6,15.79 97.75,15.64 99.73,15.64 100.72,16.63 JP5.13
N$8  (via drill 0.33)
  Top 0.152: 14.5,6.3 13.86,5.66 C11.2 | 14.5,6.3 14.85,6.65 15.84,6.65 IC6.3 | IC3.4 26.96,16.78 v26.96,15.26 26.96,14.95 30.7,11.22 IC3.16 | v13.4,7.41 14.5,6.3 | v11.65,7.49 11.65,8.17 v12.18,8.7
  Bottom 0.152: v13.4,7.41 11.72,7.41 v11.65,7.49 | v12.18,8.7 18.73,15.26 v26.96,15.26
N$9
  Top 0.152: CHG.A 10.27,1.39 10.27,2.46 11.42,3.6 RC1.1
N$11  (via drill 0.33)
  Top 0.152: v23.38,13.05 23.15,13.28 23.15,16.78 IC3.7 | v20.64,10.3 20.64,9.77 21.32,9.08 X2.1
  Bottom 0.152: v20.64,10.3 v23.38,13.05
N$13
  Top 0.152: IC3.8 21.86,16.78 21.86,13.73 23.76,11.83 23.76,9.08 X2.3
N$15  (via drill 0.33)
  Top 0.152: BATTPOWER.1 69.94,15.79 70.85,15.79 71.62,16.55 RM1.2 71.77,16.55 72.38,15.94 v72.99,15.94 | v83.2,13.81 82.21,12.82 81.29,12.82 C12.2
  Bottom 0.152: v83.2,13.81 84.26,14.88 84.26,15.33 83.81,15.79 73.14,15.79 v72.99,15.94
N$16
  Top 0.152: RSD1.2 81.83,3.37 81.83,4.36 87.54,10.07 91.43,10.07 92.8,11.45 93.48,11.45 94.02,11.98 94.02,12.51 U$1.DAT1
N$17
  Top 0.152: STAT.A 1.51,10.53 1.51,10.84 5.17,14.49 RC2.1
N$18  (via drill 0.33)
  Top 0.152: v86.17,7.87 85.94,7.87 83.05,4.97 83.05,0.93 82.59,0.47 80.91,0.47 78.4,2.99 78.4,4.21 79.31,5.12 79.31,5.58 RSD2.1 | v85.71,10.61 85.71,11.83 86.4,12.51 U$1.DAT2
  Bottom 0.152: v86.17,7.87 86.17,8.02 85.71,8.47 v85.71,10.61
RESET  (via drill 0.33)
  Top 0.152: v36.26,16.78 36.87,16.17 36.87,15.64 IC1.29 | v25.59,7.79 25.59,8.93 25.51,9.01 RRST.1 | 23.8,3.33 23.91,3.45 23.91,4.51 25.06,5.66 25.44,5.66 26.43,6.65 v26.43,6.95 | 23.8,3.33 21.7,1.24 21.32,1.24 C6.1 | v51.57,1.31 v53.1,2.84 | 23.8,3.33 v24.22,2.91
  Bottom 0.152: v36.26,16.78 35.5,16.78 35.27,16.55 31.23,16.55 30.09,15.41 30.09,12.29 v25.59,7.79 v26.43,6.95 | v53.1,2.84 59.96,2.84 61.56,4.44 61.56,4.67 62.32,5.43 62.62,5.43 64.15,6.95 65.21,6.95 ISP.5 | v51.57,1.31 28.79,1.31 28.49,1.62 28.03,1.62 27.88,1.46 25.67,1.46 v24.22,2.91
RST  (via drill 0.33)
  Top 0.152: v28.26,1.01 29.4,2.15 30.09,2.15 31.23,3.29 31.23,4.51 31.08,4.67 30.24,4.67 26.66,8.25 26.66,9.77 26.89,10 27.04,10 28.18,11.14 IC3.14 | v18.2,1.01 19.11,1.01 19.27,1.16 C6.2
  Bottom 0.152: v18.2,1.01 v28.26,1.01
RTC_BATT  (via drill 0.33)
  Top 0.152: v61.02,7.18 62.24,5.96 67.5,5.96 68.11,5.35 71.62,5.35 74.43,2.53 74.43,2 RTC.14 | v59.5,8.7 59.5,9.16 58.05,10.61 BAT.P$2
  Bottom 0.152: v59.5,8.7 v61.02,7.18
RXD  (via drill 0.33)
  Top 0.152: v29.48,15.71 29.48,16.78 IC3.2 | v35.04,17.16 36.03,16.17 36.03,15.64 IC1.30
  Bottom 0.152: v29.48,15.71 29.93,15.71 31.38,17.16 v35.04,17.16
SCK  (via drill 0.33)
  Top 0.152: v90.82,13.96 90.82,12.59 U$1.CLK 90.82,12.51 90.82,11.9 89.29,10.38 87.39,10.38 85.79,8.78 82.21,8.78 81.45,8.02 81.45,7.56 81.22,7.33 79.08,7.33 78.55,7.87 76.8,7.87 75.58,6.65 75.04,6.65 74.66,6.27 v70.62,6.27 | v47,5.43 43.95,8.47 41.59,8.47 IC1.17
  Bottom 0.152: v90.82,13.96 91.2,13.96 94.7,10.46 96.84,10.46 98.21,9.08 JP5.8 | v47,5.43 49.67,5.43 52.87,2.23 61.63,2.23 62.78,3.37 64.22,3.37 65.21,4.36 ISP.3 65.29,4.44 65.44,4.44 67.27,6.27 v70.62,6.27
SCL  (via drill 0.33)
  Top 0.152: v38.39,16.86 37.71,16.17 37.71,15.64 IC1.28 | I2C1.2 57.98,16.25 57.06,17.16 56.6,17.16 56.38,16.93 v55.99,16.93 55.77,16.93 52.79,13.96 52.79,13.35 53.94,12.21 55.38,12.21 56.22,13.05 61.4,13.05 63.31,11.14 63.31,10.68 IC5.6 63.39,10.61 63.39,9.62 64.07,8.93 67.58,8.93 69.63,6.88 v73.67,6.88 | v76.34,4.21 77.03,3.52 77.03,2 RTC.16 | v99.5,4.51 99.5,11.75 100.72,12.97 100.72,14.04 JP5.11
  Bottom 0.152: v38.39,16.86 39,17.47 55.46,17.47 v55.99,16.93 | v73.67,6.88 v76.34,4.21 76.34,4.28 76.87,4.82 92.04,4.82 93.94,2.91 98.67,2.91 99.5,3.75 v99.5,4.51
SDA  (via drill 0.33)
  Top 0.152: v39.23,16.86 38.54,16.17 38.54,15.64 IC1.27 | I2C2.2 49.67,16.55 49.97,16.86 v50.81,16.86 51.8,15.87 51.8,13.88 53.78,11.9 55.54,11.9 56.38,12.74 59.73,12.74 61.44,11.03 | 61.44,11.03 61.79,10.68 62.01,10.68 IC5.5 | v75.73,5.73 75.73,2 RTC.15 | v74.51,6.95 73.83,7.64 69.33,7.64 v66.74,10.23 | 61.44,11.03 v61.25,10.84 | v83.81,16.4 v89.22,16.4 | v64.3,13.35 64.45,13.35 v65.52,12.29
  Bottom 0.152: v50.81,16.86 v39.23,16.86 | v74.51,6.95 v75.73,5.73 | 65.52,10.23 61.86,10.23 v61.25,10.84 | 65.52,10.23 v66.74,10.23 | v89.22,16.4 92.57,13.05 98.13,13.05 99.58,11.6 100.72,11.6 JP5.9 | v83.81,16.4 82.21,16.4 81.98,16.17 73.6,16.17 73.22,16.55 67.5,16.55 v64.3,13.35 | 65.52,10.23 v65.52,12.29
TXD
  Top 0.152: IC3.3 28.26,16.78 28.26,15.03 29.25,14.04 30.85,14.04 33.29,16.48 34.89,16.48 35.27,16.09 35.27,15.64 IC1.31
VBAT  (via drill 0.33)
  Top 0.152: v68.87,14.72 67.88,14.72 BATTPOWER.2 67.88,14.65 67.88,14.19 66.74,13.05 65.44,13.05 64.53,13.96 63.61,13.96 63.31,13.66 55.54,13.66 v55,13.12 | v96.69,15.1 v83.66,15.1 | v25.21,4.97 26.2,3.98 30.39,3.98 J1.2 | v20.26,5.96 20.71,5.96 21.02,6.27 IC2.3 | JP1.2 2.04,16.32 3.8,16.32 4.79,15.33 6.01,15.33 6.16,15.18 6.16,13.88 5.7,13.43 5.7,7.71 7.68,5.73 CN1.1 | v48.98,7.1 48.98,6.57 v45.17,2.76
  Bottom 0.152: v68.87,14.72 82.05,14.72 82.44,14.34 82.89,14.34 v83.66,15.1 | v96.69,15.1 JP5.14 | JP1.2 2.04,16.32 10.27,8.09 12.41,8.09 13.63,9.31 17.21,9.31 20.26,6.27 v20.26,5.96 21.25,4.97 v25.21,4.97 25.59,4.59 27.19,4.59 29.02,2.76 v45.17,2.76 | v48.98,7.1 v55,13.12
VBUS  (via drill 0.33)
  Top 0.152: C10.1 7.23,14.49 6.01,13.28 6.01,11.52 6.92,10.61 6.92,10.15 C1.1 6.92,10.07 8.98,8.02 9.06,8.02 11.42,5.66 RC1.2 11.27,5.88 v12.1,6.72 | v16.68,5.81 17.36,6.49 17.36,6.65 IC6.2 | v16.98,8.7 16.22,9.47 X1.VBUS | v20.26,4.44 20.33,4.44 21.02,3.75 IC2.4
  Bottom 0.152: 16.68,6.72 16.68,8.4 v16.98,8.7 | 16.68,6.72 v16.68,5.81 18.89,5.81 v20.26,4.44 20.41,4.28 27.04,4.28 29.4,1.92 62.7,1.92 ISP.2 | 16.68,6.72 v12.1,6.72
VCC  (via drill 0.33)
  Top 0.152: v78.7,9.39 80,8.09 80.68,8.09 SDPWER.2 | v76.19,10.46 76.19,11.68 75.81,12.06 RTC.2 75.81,12.13 76.26,12.59 76.26,13.5 | v79.92,14.11 80,14.11 REMOTE.2 | 76.26,13.5 76.26,14.88 C4.2 | v60.26,14.95 59.96,15.26 59.96,16.17 I2C1.1 | v64,12.13 64,9.47 64.22,9.24 64.99,9.24 65.82,10.07 65.82,10.61 IC5.8 | 65.9,10.68 IC5.8 | 76.26,13.5 67.73,13.5 65.9,11.68 65.9,10.76 IC5.8 | 33.9,10.91 33.9,11.29 33.52,11.68 33.06,11.68 IC1.4 | 33.9,10.91 33.9,10.53 33.52,10.15 33.06,10.15 IC1.6 32.98,10.07 32.45,10.07 31.92,9.54 v31.92,7.87 | 29.1,7.87 C3.1 29.02,9.01 RRST.2 | 29.1,7.87 29.1,6.27 29.71,5.66 30.54,5.66 31.38,4.82 32.52,4.82 IC4.3 | 29.1,7.87 v29.93,7.87 | 47.12,14.23 47.69,14.8 47.69,16.48 I2C2.1 | 47.12,14.23 42.28,9.39 41.59,9.39 IC1.18 41.52,9.39 41.06,9.39 v40.14,10.3 | v36.64,10.91 33.9,10.91 | v58.28,8.86 57.44,8.86 56.07,7.49 53.86,7.49 47.12,14.23
  Bottom 0.152: v78.7,9.39 77.25,9.39 v76.19,10.46 76.26,10.46 v79.92,14.11 | v60.26,14.95 60.64,14.95 62.36,13.24 | 62.36,13.24 63.46,12.13 v64,12.13 | v29.93,7.87 v31.92,7.87 | v36.64,10.91 39.54,10.91 v40.14,10.3 | 62.36,13.24 58.28,9.16 v58.28,8.86
VDD
  Top 0.152: J1.1 30.47,6.34 32.52,6.34 34.05,4.82 IC4.2 34.13,4.74 37.1,1.77 37.48,1.77 C2.1

### Text on the board
tNames: VBAT